# Altium schematic sheet custom_line_V1_mux3.SchDoc
size 209 x 297 mm
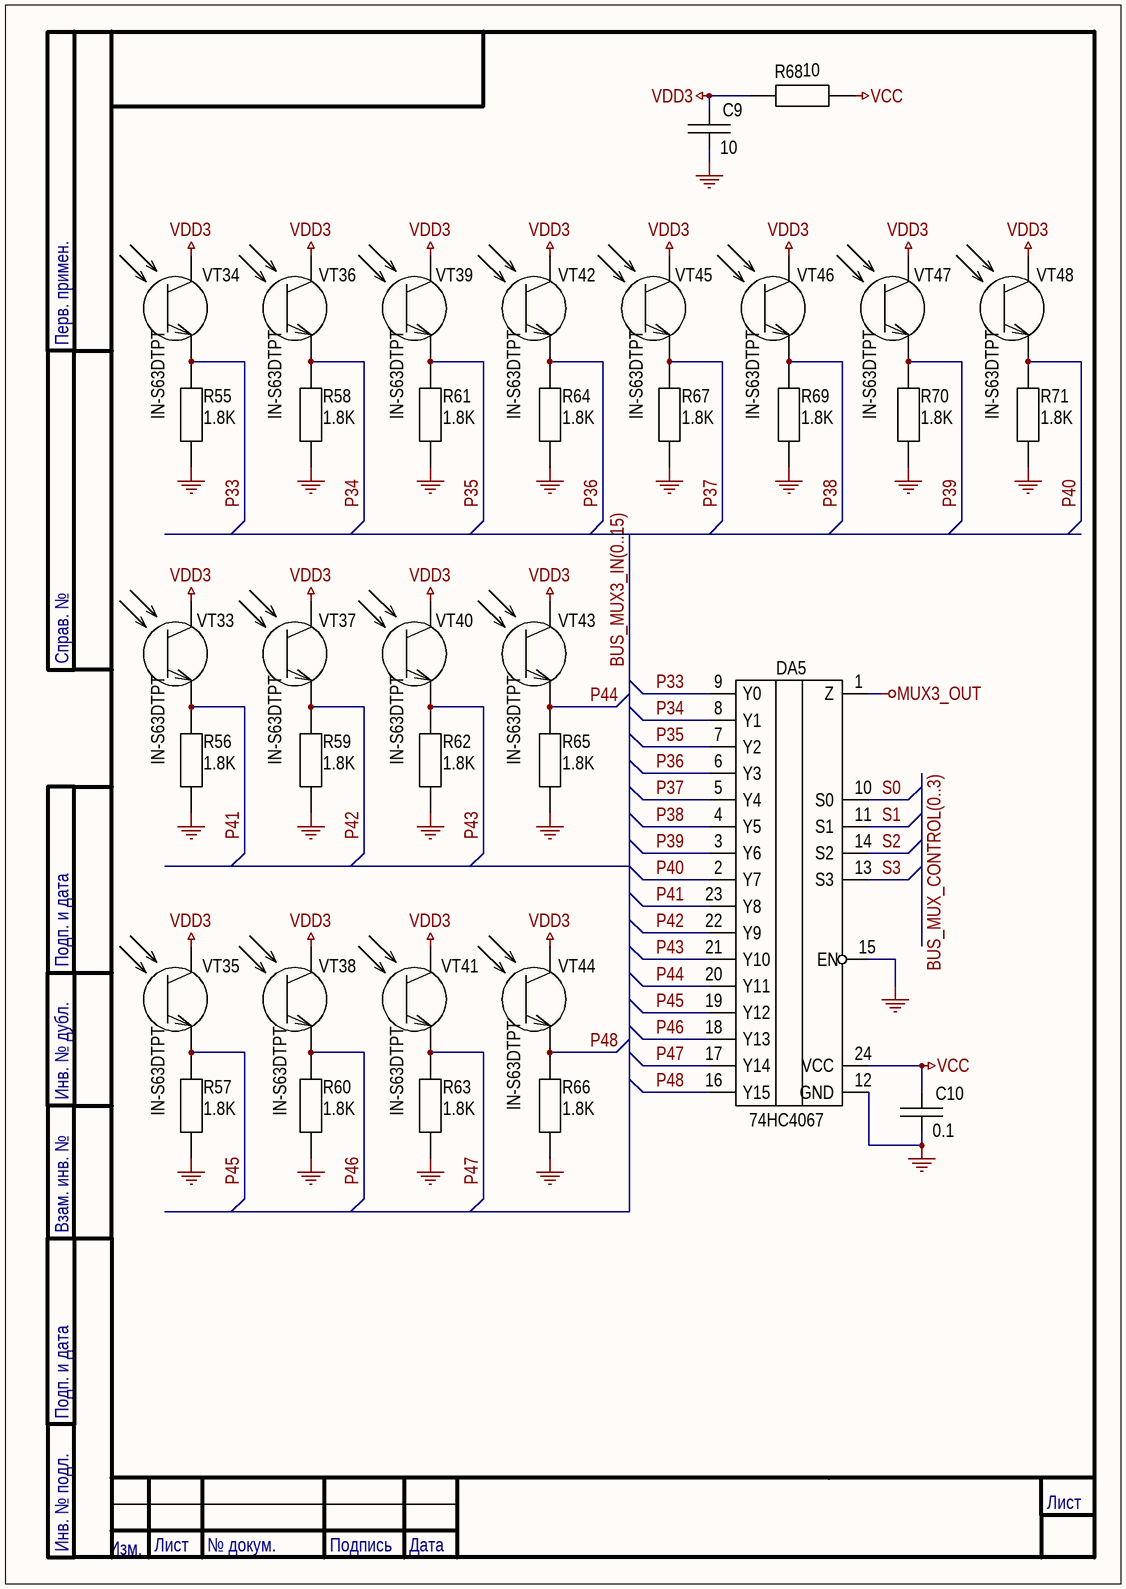
[diagram p0: custom_line_V1_mux3.SchDoc]

## Parts
C9  10  [CC_0805]
C10  0.1  [CC_0603]
DA5  74HC4067  [TSSOP-24]
R55  1.8K  [RC_0603_SMALL]
R56  1.8K  [RC_0603_SMALL]
R57  1.8K  [RC_0603_SMALL]
R58  1.8K  [RC_0603_SMALL]
R59  1.8K  [RC_0603_SMALL]
R60  1.8K  [RC_0603_SMALL]
R61  1.8K  [RC_0603_SMALL]
R62  1.8K  [RC_0603_SMALL]
R63  1.8K  [RC_0603_SMALL]
R64  1.8K  [RC_0603_SMALL]
R65  1.8K  [RC_0603_SMALL]
R66  1.8K  [RC_0603_SMALL]
R67  1.8K  [RC_0603_SMALL]
R68  10  [RC_0603_SMALL]
R69  1.8K  [RC_0603_SMALL]
R70  1.8K  [RC_0603_SMALL]
R71  1.8K  [RC_0603_SMALL]
VT33  IN-S63DTPT  [LED_0603]
VT34  IN-S63DTPT  [LED_0603]
VT35  IN-S63DTPT  [LED_0603]
VT36  IN-S63DTPT  [LED_0603]
VT37  IN-S63DTPT  [LED_0603]
VT38  IN-S63DTPT  [LED_0603]
VT39  IN-S63DTPT  [LED_0603]
VT40  IN-S63DTPT  [LED_0603]
VT41  IN-S63DTPT  [LED_0603]
VT42  IN-S63DTPT  [LED_0603]
VT43  IN-S63DTPT  [LED_0603]
VT44  IN-S63DTPT  [LED_0603]
VT45  IN-S63DTPT  [LED_0603]
VT46  IN-S63DTPT  [LED_0603]
VT47  IN-S63DTPT  [LED_0603]
VT48  IN-S63DTPT  [LED_0603]

## Nets
GND: C9.1 C10.1 DA5.12(GND) DA5.15(EN) R55.1 R56.1 R57.1 R58.1 R59.1 R60.1 R61.1 R62.1 R63.1 R64.1 R65.1 R66.1 R67.1 R69.1 R70.1 R71.1
MUX3_OUT: DA5.1(Z)
VCC: C10.2 DA5.24(VCC) R68.1
VDD3: C9.2 R68.2 VT33.1(C) VT34.1(C) VT35.1(C) VT36.1(C) VT37.1(C) VT38.1(C) VT39.1(C) VT40.1(C) VT41.1(C) VT42.1(C) VT43.1(C) VT44.1(C) VT45.1(C) VT46.1(C) VT47.1(C) VT48.1(C)
P33: DA5.9(Y0) R55.2 VT34.2(E)
P34: DA5.8(Y1) R58.2 VT36.2(E)
P35: DA5.7(Y2) R61.2 VT39.2(E)
P36: DA5.6(Y3) R64.2 VT42.2(E)
P37: DA5.5(Y4) R67.2 VT45.2(E)
P38: DA5.4(Y5) R69.2 VT46.2(E)
P39: DA5.3(Y6) R70.2 VT47.2(E)
P40: DA5.2(Y7) R71.2 VT48.2(E)
P41: DA5.23(Y8) R56.2 VT33.2(E)
P42: DA5.22(Y9) R59.2 VT37.2(E)
P43: DA5.21(Y10) R62.2 VT40.2(E)
P44: DA5.20(Y11) R65.2 VT43.2(E)
P45: DA5.19(Y12) R57.2 VT35.2(E)
P46: DA5.18(Y13) R60.2 VT38.2(E)
P47: DA5.17(Y14) R63.2 VT41.2(E)
P48: DA5.16(Y15) R66.2 VT44.2(E)
S0: DA5.10(S0)
S1: DA5.11(S1)
S2: DA5.14(S2)
S3: DA5.13(S3)

## Buses and harness runs
bus BUS_MUX3_IN(0..15)
bus BUS_MUX_CONTROL(0..3)

## Notes on the sheet
- Перв. примен.
- Справ. №
- Подп. и дата
- Инв. № дубл.
- Взам. инв. №
- Изм.
- Лист
- Инв. № подл.
- № докум.
- Подпись
- Дата

## Library data of the parts
C9 = C: type: CC-0805-106-16V-X7R-10%; value: 10uF
C10 = C: type: CC-0603-B-104-K-50; value: 0.1uF
DA5 = 74HCT4067: 74HC4067PW; type: 74HC4067
R55-R67 R69-R71 = R: power: 0.125W; value: 100K; type: RC-0603-104-5%
R68 = R: power: 0.125W; type: RC-0603-R10-5%; value: 10
VT33-VT48 = phototransistor: Phototransistor (Inolux); type: IN-S63DTPT